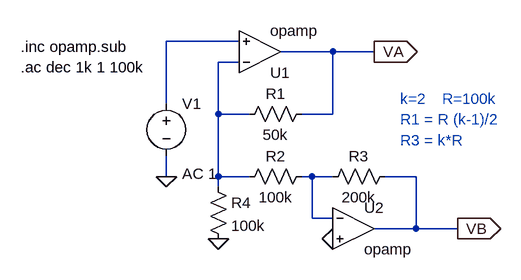
[diagram p0: schematic EJE2.asc]
EJE2.asc, the LTspice schematic file:
Version 4
SHEET 1 880 680
WIRE 80 80 -32 80
WIRE 224 96 144 96
WIRE 288 96 224 96
WIRE 80 112 48 112
WIRE -32 176 -32 80
WIRE 48 192 48 112
WIRE 96 192 48 192
WIRE 224 192 224 96
WIRE 224 192 176 192
WIRE -32 288 -32 256
WIRE 48 288 48 192
WIRE 96 288 48 288
WIRE 192 288 176 288
WIRE 224 288 192 288
WIRE 352 288 304 288
WIRE 48 304 48 288
WIRE 192 352 192 288
WIRE 224 352 192 352
WIRE 352 368 352 288
WIRE 352 368 288 368
WIRE 416 368 352 368
FLAG -32 288 0
FLAG 416 368 VB
IOPIN 416 368 Out
FLAG 224 384 0
FLAG 48 384 0
FLAG 288 96 VA
IOPIN 288 96 Out
SYMBOL OpAmps\\opamp 112 160 M180
SYMATTR InstName U1
SYMATTR SpiceLine2 GBW=100Meg
SYMBOL voltage -32 160 R0
WINDOW 123 24 124 Left 2
WINDOW 39 0 0 Left 0
SYMATTR InstName V1
SYMATTR Value ""
SYMATTR Value2 AC 1
SYMBOL res 192 176 R90
WINDOW 0 0 56 VBottom 2
WINDOW 3 32 56 VTop 2
SYMATTR InstName R1
SYMATTR Value 50k
SYMBOL res 192 272 R90
WINDOW 0 0 56 VBottom 2
WINDOW 3 32 56 VTop 2
SYMATTR InstName R2
SYMATTR Value 100k
SYMBOL res 320 272 R90
WINDOW 0 0 56 VBottom 2
WINDOW 3 32 56 VTop 2
SYMATTR InstName R3
SYMATTR Value 200k
SYMBOL OpAmps\\opamp 256 304 R0
SYMATTR InstName U2
SYMATTR SpiceLine2 GBW=100Meg
SYMBOL res 32 288 R0
SYMATTR InstName R4
SYMATTR Value 100k
TEXT -256 88 Left 2 !.inc opamp.sub
TEXT -256 120 Left 2 !.ac dec 1k 1 100k
TEXT 328 200 Left 2 ;R1 = R (k-1)/2
TEXT 328 168 Left 2 ;k=2
TEXT 392 168 Left 2 ;R=100k
TEXT 328 232 Left 2 ;R3 = k*R

The netlist it stands for:
* EJE2.asc
XU1 N002 N001 VA opamp Aol=100K GBW=100Meg  ; pins invin noninvin out
V1 N001 0 AC 1
R1 VA N002 50k
R2 N003 N002 100k
R3 VB N003 200k
XU2 N003 0 VB opamp Aol=100K GBW=100Meg  ; pins invin noninvin out
R4 N002 0 100k
.inc opamp.sub
.ac dec 1k 1 100k
* R1 = R (k-1)/2
* k=2
* R=100k
* R3 = k*R
.backanno
.end